# Altium schematic sheet REVERSE_PROTECTION.SchDoc
size A4; SheetNumber: 3; SheetTotal: 13
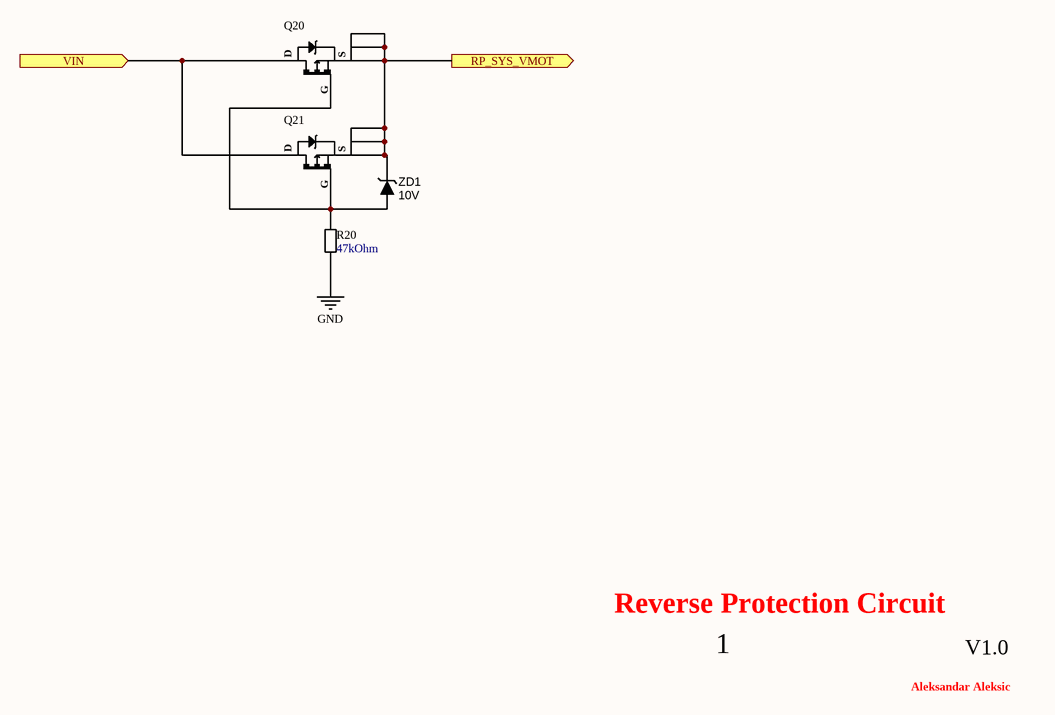
[diagram p0: REVERSE_PROTECTION.SchDoc]

## Parts
Q20  SQJ659EP PMOS  [PowerPAK SO-8L SINGLE]  (value not drawn)
Q21  SQJ659EP PMOS  [PowerPAK SO-8L SINGLE]  (value not drawn)
R20  47kOhm  [RES_0603]
ZD1  10V  [DIO_SMA]

## Ports
RP_SYS_VMOT (out), VIN (in)

## Nets
GND: R20.1
RP_SYS_VMOT: Q20.S(S1) Q21.S(S1) ZD1.1(Cathode) ; port RP_SYS_VMOT
VIN: Q20.D Q21.D ; port VIN
NetQ20_G: Q20.G Q21.G R20.2 ZD1.2(Anode)

## Notes on the sheet
- Reverse Protection Circuit
- 1
- V1.0
- Aleksandar Aleksic

## Library data of the parts
Q20 Q21 = 00000005: P-Channel 60 V 52A (Tc) 83W (Tc) Surface Mount PowerPAK® SO-8; DigiKey Part Number: SQJ459EP-T1_GE3CT-ND; Mouser Part Number: 78-SQJ459EP-T2_BE3; ComponentLink1Description: DigiKey; ComponentLink1URL: https://www.digikey.com/en/products/detail/vishay-siliconix/SQJ459EP-T1-GE3/6708881; ComponentLink2Description: Mouser; ComponentLink2URL: https://eu.mouser.com/ProductDetail/Vishay-Siliconix/SQJ459EP-T2_BE3?qs=CiayqK2gdcKpg8h0vLRPjA%3D%3D
R20 = R000010: 47 kOhms ±1% 0.1W, 1/10W Chip Resistor 0603 (1608 Metric) Moisture Resistant Thick Film; ComponentLink1Description: DigiKey; ComponentLink1URL: https://www.digikey.com/en/products/detail/yageo/RC0603FR-0747KL/727253; resistance: 47kOhm; DigiKey Part Number: 311-47.0KHRCT-ND
ZD1 = 1SMA5931-AU_R1: Zener Diode 10 V 5 W ±5% Surface Mount SMC (DO-214AB); Value: 10V; ComponentLink1Description: digikey; ComponentLink1URL: https://www.digikey.com/en/products/detail/panjit-international-inc/1SMC5347-AU-R1-000A1/15799564